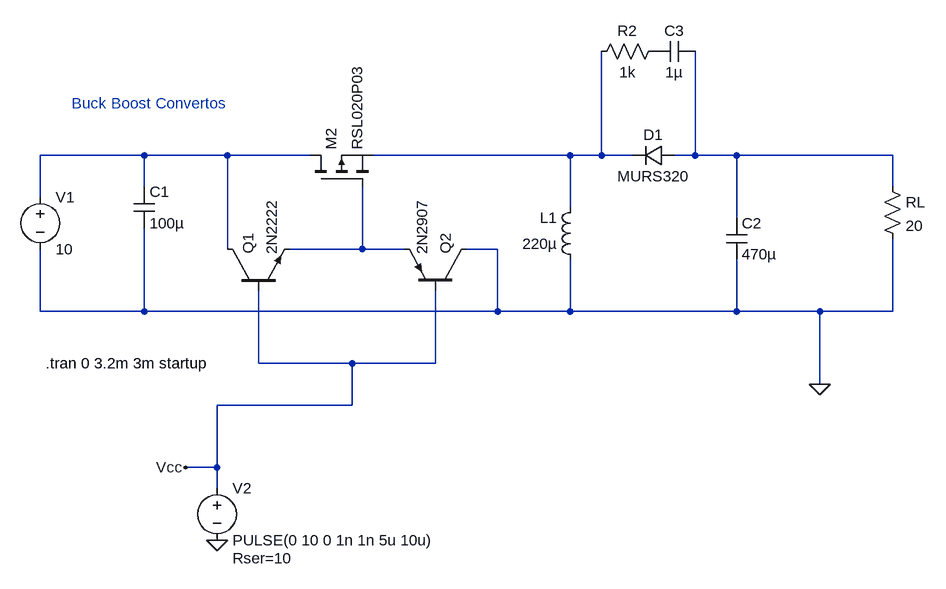
[diagram p0: schematic Buck_Boost_Converter.asc]
Buck_Boost_Converter.asc, the LTspice schematic file:
Version 4.1
SHEET 1 1576 892
WIRE 192 144 32 144
WIRE 320 144 192 144
WIRE 448 144 320 144
WIRE 848 144 544 144
WIRE 896 144 896 -16
WIRE 896 144 848 144
WIRE 944 144 896 144
WIRE 1040 144 1040 -16
WIRE 1040 144 1008 144
WIRE 1104 144 1040 144
WIRE 1344 144 1104 144
WIRE 192 192 192 144
WIRE 1344 192 1344 144
WIRE 32 208 32 144
WIRE 848 224 848 144
WIRE 1104 240 1104 144
WIRE 320 288 320 144
WIRE 528 288 528 192
WIRE 528 288 416 288
WIRE 592 288 528 288
WIRE 736 288 688 288
WIRE 32 384 32 288
WIRE 192 384 192 256
WIRE 192 384 32 384
WIRE 736 384 736 288
WIRE 736 384 192 384
WIRE 848 384 848 304
WIRE 848 384 736 384
WIRE 1104 384 1104 304
WIRE 1104 384 848 384
WIRE 1232 384 1104 384
WIRE 1344 384 1344 272
WIRE 1344 384 1232 384
WIRE 368 464 368 352
WIRE 512 464 368 464
WIRE 640 464 640 352
WIRE 640 464 512 464
WIRE 1232 496 1232 384
WIRE 512 528 512 464
WIRE 512 528 304 528
WIRE 304 624 304 528
WIRE 304 624 256 624
WIRE 304 656 304 624
FLAG 1232 496 0
FLAG 304 736 0
FLAG 256 624 Vcc
SYMBOL voltage 32 192 R0
WINDOW 123 0 0 Left 0
WINDOW 39 0 0 Left 0
SYMATTR InstName V1
SYMATTR Value 10
SYMBOL cap 176 192 R0
SYMATTR InstName C1
SYMATTR Value 100µ
SYMBOL diode 1008 128 R90
WINDOW 0 0 32 VBottom 2
WINDOW 3 32 32 VTop 2
SYMATTR InstName D1
SYMATTR Value MURS320
SYMBOL ind 864 320 R180
WINDOW 0 36 80 Left 2
WINDOW 3 36 40 Left 2
SYMATTR InstName L1
SYMATTR Value 220µ
SYMATTR SpiceLine Rser=1m
SYMBOL cap 1088 240 R0
SYMATTR InstName C2
SYMATTR Value 470µ
SYMBOL res 1328 176 R0
SYMATTR InstName RL
SYMATTR Value 20
SYMBOL npn 320 352 R270
SYMATTR InstName Q1
SYMATTR Value 2N2222
SYMBOL voltage 304 640 R0
WINDOW 123 0 0 Left 0
WINDOW 39 24 124 Left 2
SYMATTR SpiceLine Rser=10
SYMATTR InstName V2
SYMATTR Value PULSE(0 10 0 1n 1n 5u 10u)
SYMBOL pmos 448 192 R270
SYMATTR InstName M2
SYMATTR Value RSL020P03
SYMBOL res 880 0 R270
WINDOW 0 32 56 VTop 2
WINDOW 3 0 56 VBottom 2
SYMATTR InstName R2
SYMATTR Value 1k
SYMBOL cap 976 0 R270
WINDOW 0 32 32 VTop 2
WINDOW 3 0 32 VBottom 2
SYMATTR InstName C3
SYMATTR Value 1µ
SYMBOL pnp 688 352 M270
SYMATTR InstName Q2
SYMATTR Value 2N2907
TEXT 40 464 Left 2 !.tran 0 3.2m 3m startup
TEXT 80 64 Left 2 ;Buck Boost Convertos

The netlist it stands for:
* Buck_Boost_Converter.asc
V1 N001 0 10
C1 N001 0 100µ
D1 N003 N002 MURS320
L1 0 N002 220µ Rser=1m
C2 N003 0 470µ
RL N003 0 20
Q1 N001 Vcc N004 0 2N2222
V2 Vcc 0 PULSE(0 10 0 1n 1n 5u 10u) Rser=10
M2 N001 N004 N002 N002 RSL020P03
R2 N002 P001 1k
C3 P001 N003 1µ
Q2 0 Vcc N004 0 2N2907
.model D D
.lib standard.dio
.model NPN NPN
.model PNP PNP
.lib standard.bjt
.model NMOS NMOS
.model PMOS PMOS
.lib standard.mos
.tran 0 3.2m 3m startup
* Buck Boost Convertos
.backanno
.end